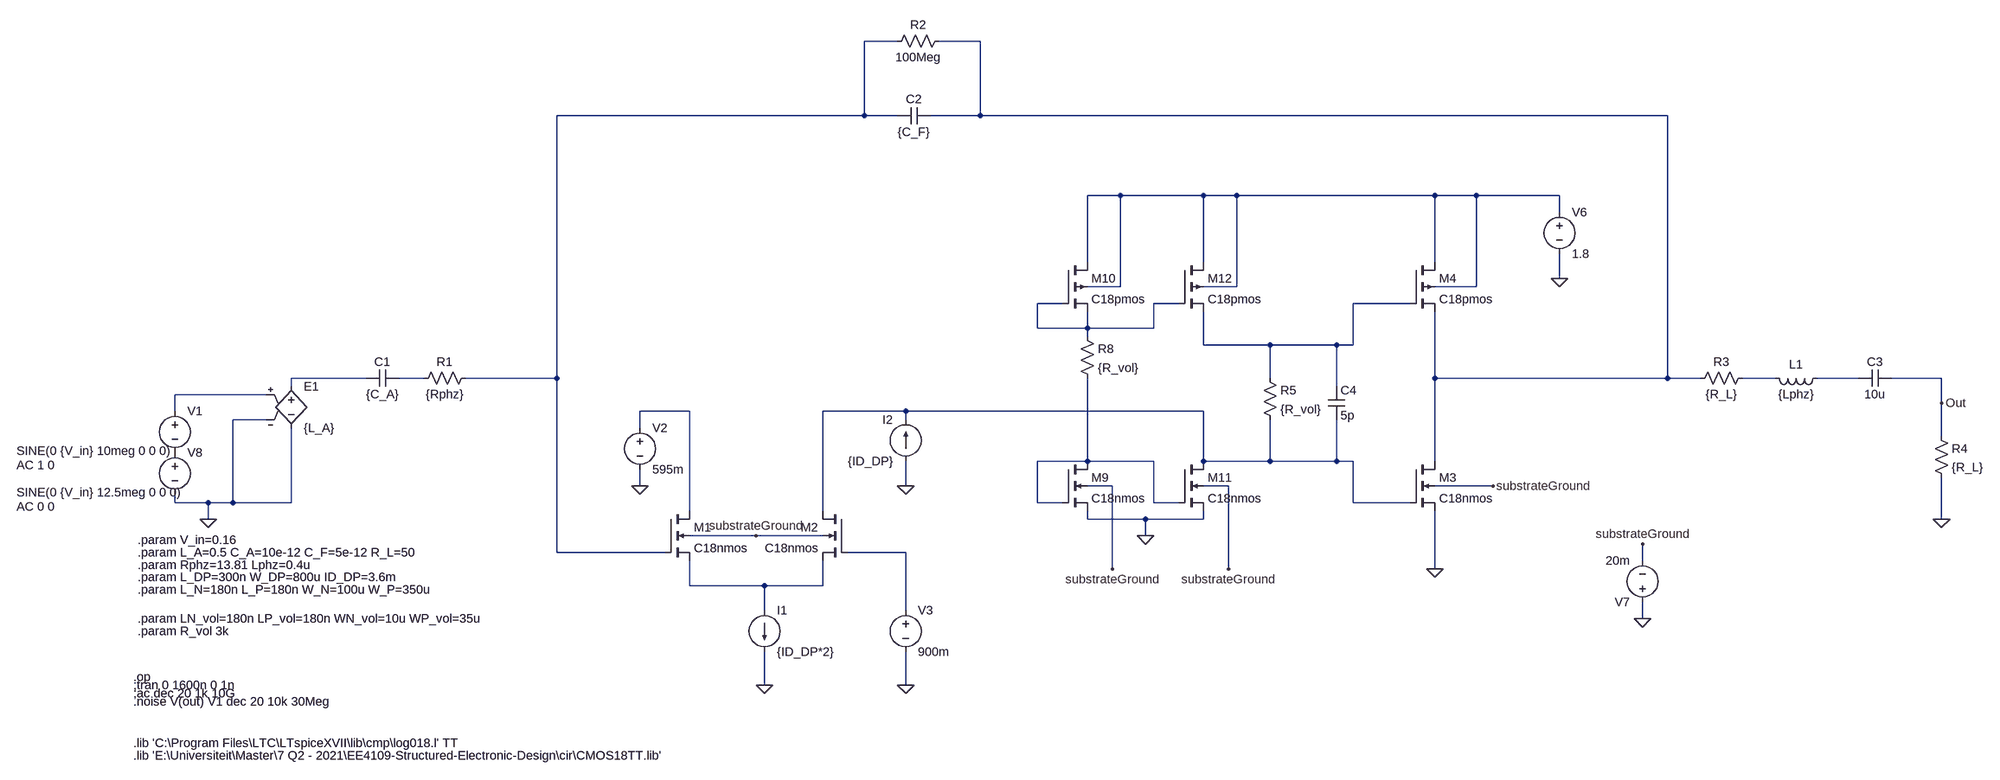
[diagram p0: schematic BiasingStep2.asc]
BiasingStep2.asc, the LTspice schematic file:
Version 4
SHEET 1 3864 1444
WIRE 1536 -768 1472 -768
WIRE 1696 -768 1616 -768
WIRE 1472 -624 1472 -768
WIRE 1472 -624 880 -624
WIRE 1536 -624 1472 -624
WIRE 1696 -624 1696 -768
WIRE 1696 -624 1600 -624
WIRE 3248 -624 1696 -624
WIRE 2096 -320 2032 -320
WIRE 2256 -320 2096 -320
WIRE 2320 -320 2256 -320
WIRE 2800 -320 2320 -320
WIRE 2880 -320 2800 -320
WIRE 3040 -320 2880 -320
WIRE 3040 -288 3040 -320
WIRE 2032 -192 2032 -320
WIRE 2256 -192 2256 -320
WIRE 2800 -192 2800 -320
WIRE 3040 -160 3040 -208
WIRE 2096 -144 2096 -320
WIRE 2096 -144 2032 -144
WIRE 2320 -144 2320 -320
WIRE 2320 -144 2256 -144
WIRE 2880 -144 2880 -320
WIRE 2880 -144 2800 -144
WIRE 1984 -112 1936 -112
WIRE 2208 -112 2160 -112
WIRE 2752 -112 2544 -112
WIRE 1936 -64 1936 -112
WIRE 2032 -64 2032 -96
WIRE 2032 -64 1936 -64
WIRE 2160 -64 2160 -112
WIRE 2160 -64 2032 -64
WIRE 2032 -48 2032 -64
WIRE 2256 -32 2256 -96
WIRE 2384 -32 2256 -32
WIRE 2512 -32 2384 -32
WIRE 2544 -32 2544 -112
WIRE 2544 -32 2512 -32
WIRE 512 32 368 32
WIRE 624 32 576 32
WIRE 880 32 880 -624
WIRE 880 32 704 32
WIRE 2384 32 2384 -32
WIRE 2800 32 2800 -96
WIRE 3248 32 3248 -624
WIRE 3248 32 2800 32
WIRE 3312 32 3248 32
WIRE 3456 32 3392 32
WIRE 3616 32 3536 32
WIRE 3776 32 3680 32
WIRE 368 48 368 32
WIRE 2512 48 2512 -32
WIRE 320 64 144 64
WIRE 3776 80 3776 32
WIRE 144 96 144 64
WIRE 1136 96 1040 96
WIRE 1552 96 1392 96
WIRE 2256 96 1552 96
WIRE 320 112 256 112
WIRE 1552 112 1552 96
WIRE 1040 128 1040 96
WIRE 3776 144 3776 80
WIRE 2032 192 2032 32
WIRE 2032 192 1936 192
WIRE 2160 192 2032 192
WIRE 2256 192 2256 96
WIRE 2384 192 2384 112
WIRE 2384 192 2256 192
WIRE 2512 192 2512 112
WIRE 2512 192 2384 192
WIRE 2544 192 2512 192
WIRE 2800 192 2800 32
WIRE 1040 240 1040 208
WIRE 1552 240 1552 192
WIRE 2080 240 2032 240
WIRE 2304 240 2256 240
WIRE 2912 240 2800 240
WIRE 144 272 144 256
WIRE 208 272 144 272
WIRE 256 272 256 112
WIRE 256 272 208 272
WIRE 368 272 368 128
WIRE 368 272 256 272
WIRE 1936 272 1936 192
WIRE 1984 272 1936 272
WIRE 2160 272 2160 192
WIRE 2208 272 2160 272
WIRE 2544 272 2544 192
WIRE 2752 272 2544 272
WIRE 1136 288 1136 96
WIRE 1392 288 1392 96
WIRE 208 304 208 272
WIRE 2032 304 2032 288
WIRE 2144 304 2032 304
WIRE 2256 304 2256 288
WIRE 2256 304 2144 304
WIRE 3776 304 3776 224
WIRE 1264 336 1136 336
WIRE 1392 336 1264 336
WIRE 2144 336 2144 304
WIRE 880 368 880 32
WIRE 1088 368 880 368
WIRE 1552 368 1440 368
WIRE 3200 384 3200 352
WIRE 2080 400 2080 240
WIRE 2304 400 2304 240
WIRE 2800 400 2800 288
WIRE 1136 432 1136 384
WIRE 1280 432 1136 432
WIRE 1392 432 1392 384
WIRE 1392 432 1280 432
WIRE 1280 480 1280 432
WIRE 1552 480 1552 368
WIRE 3200 496 3200 464
WIRE 1280 624 1280 560
WIRE 1552 624 1552 560
FLAG 208 304 0
FLAG 1280 624 0
FLAG 1040 240 0
FLAG 1552 624 0
FLAG 1552 240 0
FLAG 2800 400 0
FLAG 3040 -160 0
FLAG 3776 304 0
FLAG 2912 240 substrateGround
FLAG 1264 336 substrateGround
FLAG 3200 352 substrateGround
FLAG 3200 496 0
FLAG 3776 80 Out
FLAG 2144 336 0
FLAG 2304 400 substrateGround
FLAG 2080 400 substrateGround
DATAFLAG 880 208 ""
DATAFLAG 1424 96 ""
DATAFLAG 3040 32 ""
DATAFLAG 3776 32 ""
DATAFLAG 1136 48 "Id(M1)"
DATAFLAG 1136 96 ""
DATAFLAG 1424 48 "Id(M2)"
DATAFLAG 1280 432 ""
DATAFLAG 2720 -240 "Id(M4)"
DATAFLAG 2720 352 "Id(M3)"
DATAFLAG 1168 544 "I(I1)"
DATAFLAG 2672 272 ""
DATAFLAG 2688 -112 ""
SYMBOL voltage 144 80 R0
WINDOW 3 -305 92 Left 2
WINDOW 123 -305 120 Left 2
WINDOW 39 0 0 Left 0
SYMATTR Value SINE(0 {V_in} 10meg 0 0 0)
SYMATTR Value2 AC 1 0
SYMATTR InstName V1
SYMBOL e 368 32 R0
SYMATTR InstName E1
SYMATTR Value {L_A}
SYMBOL cap 576 16 R90
WINDOW 0 0 32 VBottom 2
WINDOW 3 32 32 VTop 2
SYMATTR InstName C1
SYMATTR Value {C_A}
SYMBOL res 720 16 R90
WINDOW 0 0 56 VBottom 2
WINDOW 3 32 56 VTop 2
SYMATTR InstName R1
SYMATTR Value {Rphz}
SYMBOL current 1280 480 R0
WINDOW 123 0 0 Left 0
WINDOW 39 0 0 Left 0
SYMATTR InstName I1
SYMATTR Value {ID_DP*2}
SYMBOL voltage 1040 112 R0
WINDOW 123 0 0 Left 0
WINDOW 39 0 0 Left 0
SYMATTR InstName V2
SYMATTR Value 595m
SYMBOL voltage 1552 464 R0
WINDOW 123 0 0 Left 0
WINDOW 39 0 0 Left 0
SYMATTR InstName V3
SYMATTR Value 900m
SYMBOL current 1552 192 R180
WINDOW 0 24 80 Left 2
WINDOW 3 24 0 Left 2
WINDOW 123 0 0 Left 0
WINDOW 39 0 0 Left 0
SYMATTR InstName I2
SYMATTR Value {ID_DP}
SYMBOL nmos4 1088 288 R0
SYMATTR InstName M1
SYMATTR Value C18nmos
SYMATTR Value2 l={L_DP} w={W_DP}
SYMBOL nmos4 1440 288 M0
SYMATTR InstName M2
SYMATTR Value C18nmos
SYMATTR Value2 l={L_DP} w={W_DP}
SYMBOL nmos4 2752 192 R0
SYMATTR InstName M3
SYMATTR Value C18nmos
SYMATTR Value2 l={L_N} w={W_N}
SYMBOL pmos4 2752 -192 R0
SYMATTR InstName M4
SYMATTR Value C18pmos
SYMATTR Value2 l={L_P} w={W_P}
SYMBOL voltage 3040 -304 R0
WINDOW 123 0 0 Left 0
WINDOW 39 0 0 Left 0
SYMATTR InstName V6
SYMATTR Value 1.8
SYMBOL cap 1600 -640 R90
WINDOW 0 0 32 VBottom 2
WINDOW 3 32 32 VTop 2
SYMATTR InstName C2
SYMATTR Value {C_F}
SYMBOL res 1632 -784 R90
WINDOW 0 0 56 VBottom 2
WINDOW 3 32 56 VTop 2
SYMATTR InstName R2
SYMATTR Value 100Meg
SYMBOL res 3408 16 R90
WINDOW 0 0 56 VBottom 2
WINDOW 3 32 56 VTop 2
SYMATTR InstName R3
SYMATTR Value {R_L}
SYMBOL cap 3680 16 R90
WINDOW 0 0 32 VBottom 2
WINDOW 3 32 32 VTop 2
SYMATTR InstName C3
SYMATTR Value 10u
SYMBOL res 3760 128 R0
SYMATTR InstName R4
SYMATTR Value {R_L}
SYMBOL voltage 3200 480 R180
WINDOW 123 0 0 Left 0
WINDOW 39 0 0 Left 0
SYMATTR InstName V7
SYMATTR Value 20m
SYMBOL ind 3552 16 R90
WINDOW 0 5 56 VBottom 2
WINDOW 3 32 56 VTop 2
SYMATTR InstName L1
SYMATTR Value {Lphz}
SYMBOL voltage 144 160 R0
WINDOW 3 -305 92 Left 2
WINDOW 123 -305 120 Left 2
WINDOW 39 0 0 Left 0
SYMATTR Value SINE(0 {V_in} 12.5meg 0 0 0)
SYMATTR Value2 AC 0 0
SYMATTR InstName V8
SYMBOL nmos4 1984 192 R0
SYMATTR InstName M9
SYMATTR Value C18nmos
SYMATTR Value2 l={LN_vol} w={WN_vol} m=6
SYMBOL pmos4 1984 -192 R0
SYMATTR InstName M10
SYMATTR Value C18pmos
SYMATTR Value2 l={LP_vol} w={WP_vol} m=6
SYMBOL res 2016 -64 R0
SYMATTR InstName R8
SYMATTR Value {R_vol}
SYMBOL cap 2496 48 R0
SYMATTR InstName C4
SYMATTR Value 5p
SYMBOL nmos4 2208 192 R0
SYMATTR InstName M11
SYMATTR Value C18nmos
SYMATTR Value2 l={LN_vol} w={WN_vol} m=5
SYMBOL pmos4 2208 -192 R0
SYMATTR InstName M12
SYMATTR Value C18pmos
SYMATTR Value2 l={LP_vol} w={WP_vol} m=5
SYMBOL res 2368 16 R0
SYMATTR InstName R5
SYMATTR Value {R_vol}
TEXT 72 368 Left 2 !.param L_A=0.5 C_A=10e-12 C_F=5e-12 R_L=50
TEXT 72 392 Left 2 !.param Rphz=13.81 Lphz=0.4u
TEXT 72 416 Left 2 !.param L_DP=300n W_DP=800u ID_DP=3.6m
TEXT 72 440 Left 2 !.param L_N=180n L_P=180n W_N=100u W_P=350u
TEXT 64 608 Left 2 !.op
TEXT 64 760 Left 2 !.lib 'E:\\Universiteit\\Master\\7 Q2 - 2021\\EE4109-Structured-Electronic-Design\\cir\\CMOS18TT.lib'
TEXT 64 736 Left 2 !.lib 'C:\\Program Files\\LTC\\LTspiceXVII\\lib\\cmp\\log018.l' TT
TEXT 72 344 Left 2 !.param V_in=0.16
TEXT 64 624 Left 2 !;tran 0 1600n 0 1n
TEXT 64 640 Left 2 !;ac dec 20 1k 10G
TEXT 64 656 Left 2 !.noise V(out) V1 dec 20 10k 30Meg
TEXT 72 496 Left 2 !.param LN_vol=180n LP_vol=180n WN_vol=10u WP_vol=35u
TEXT 72 520 Left 2 !.param R_vol 3k

The netlist it stands for:
* BiasingStep2.asc
V1 N010 P001 SINE(0 {V_in} 10meg 0 0 0) AC 1 0
E1 N006 0 N010 0 {L_A}
C1 N007 N006 {C_A}
R1 N001 N007 {Rphz}
I1 N015 0 {ID_DP*2}
V2 N011 0 595m
V3 N014 0 900m
I2 0 N012 {ID_DP}
M1 N011 N001 N015 substrateGround C18nmos l={L_DP} w={W_DP}
M2 N012 N014 N015 substrateGround C18nmos l={L_DP} w={W_DP}
M3 N002 N012 0 substrateGround C18nmos l={L_N} w={W_N}
M4 N003 N005 N002 N003 C18pmos l={L_P} w={W_P}
V6 N003 0 1.8
C2 N002 N001 {C_F}
R2 N002 N001 100Meg
R3 N008 N002 {R_L}
C3 Out N009 10u
R4 Out 0 {R_L}
V7 0 substrateGround 20m
L1 N009 N008 {Lphz}
V8 P001 0 SINE(0 {V_in} 12.5meg 0 0 0) AC 0 0
M9 N013 N013 0 substrateGround C18nmos l={LN_vol} w={WN_vol} m=6
M10 N003 N004 N004 N003 C18pmos l={LP_vol} w={WP_vol} m=6
R8 N004 N013 {R_vol}
C4 N005 N012 5p
M11 N012 N013 0 substrateGround C18nmos l={LN_vol} w={WN_vol} m=5
M12 N003 N004 N005 N003 C18pmos l={LP_vol} w={WP_vol} m=5
R5 N005 N012 {R_vol}
.model NMOS NMOS
.model PMOS PMOS
.lib standard.mos
.param L_A=0.5 C_A=10e-12 C_F=5e-12 R_L=50
.param Rphz=13.81 Lphz=0.4u
.param L_DP=300n W_DP=800u ID_DP=3.6m
.param L_N=180n L_P=180n W_N=100u W_P=350u
.op
.lib 'E:\Universiteit\Master\7 Q2 - 2021\EE4109-Structured-Electronic-Design\cir\CMOS18TT.lib'
.lib 'C:\Program Files\LTC\LTspiceXVII\lib\cmp\log018.l' TT
.param V_in=0.16
;tran 0 1600n 0 1n
;ac dec 20 1k 10G
.noise V(out) V1 dec 20 10k 30Meg
.param LN_vol=180n LP_vol=180n WN_vol=10u WP_vol=35u
.param R_vol 3k
.backanno
.end